# EAGLE design dimmer (EAGLE 7.6.0)
CREVISION: 1; DESIGNER: JoseM
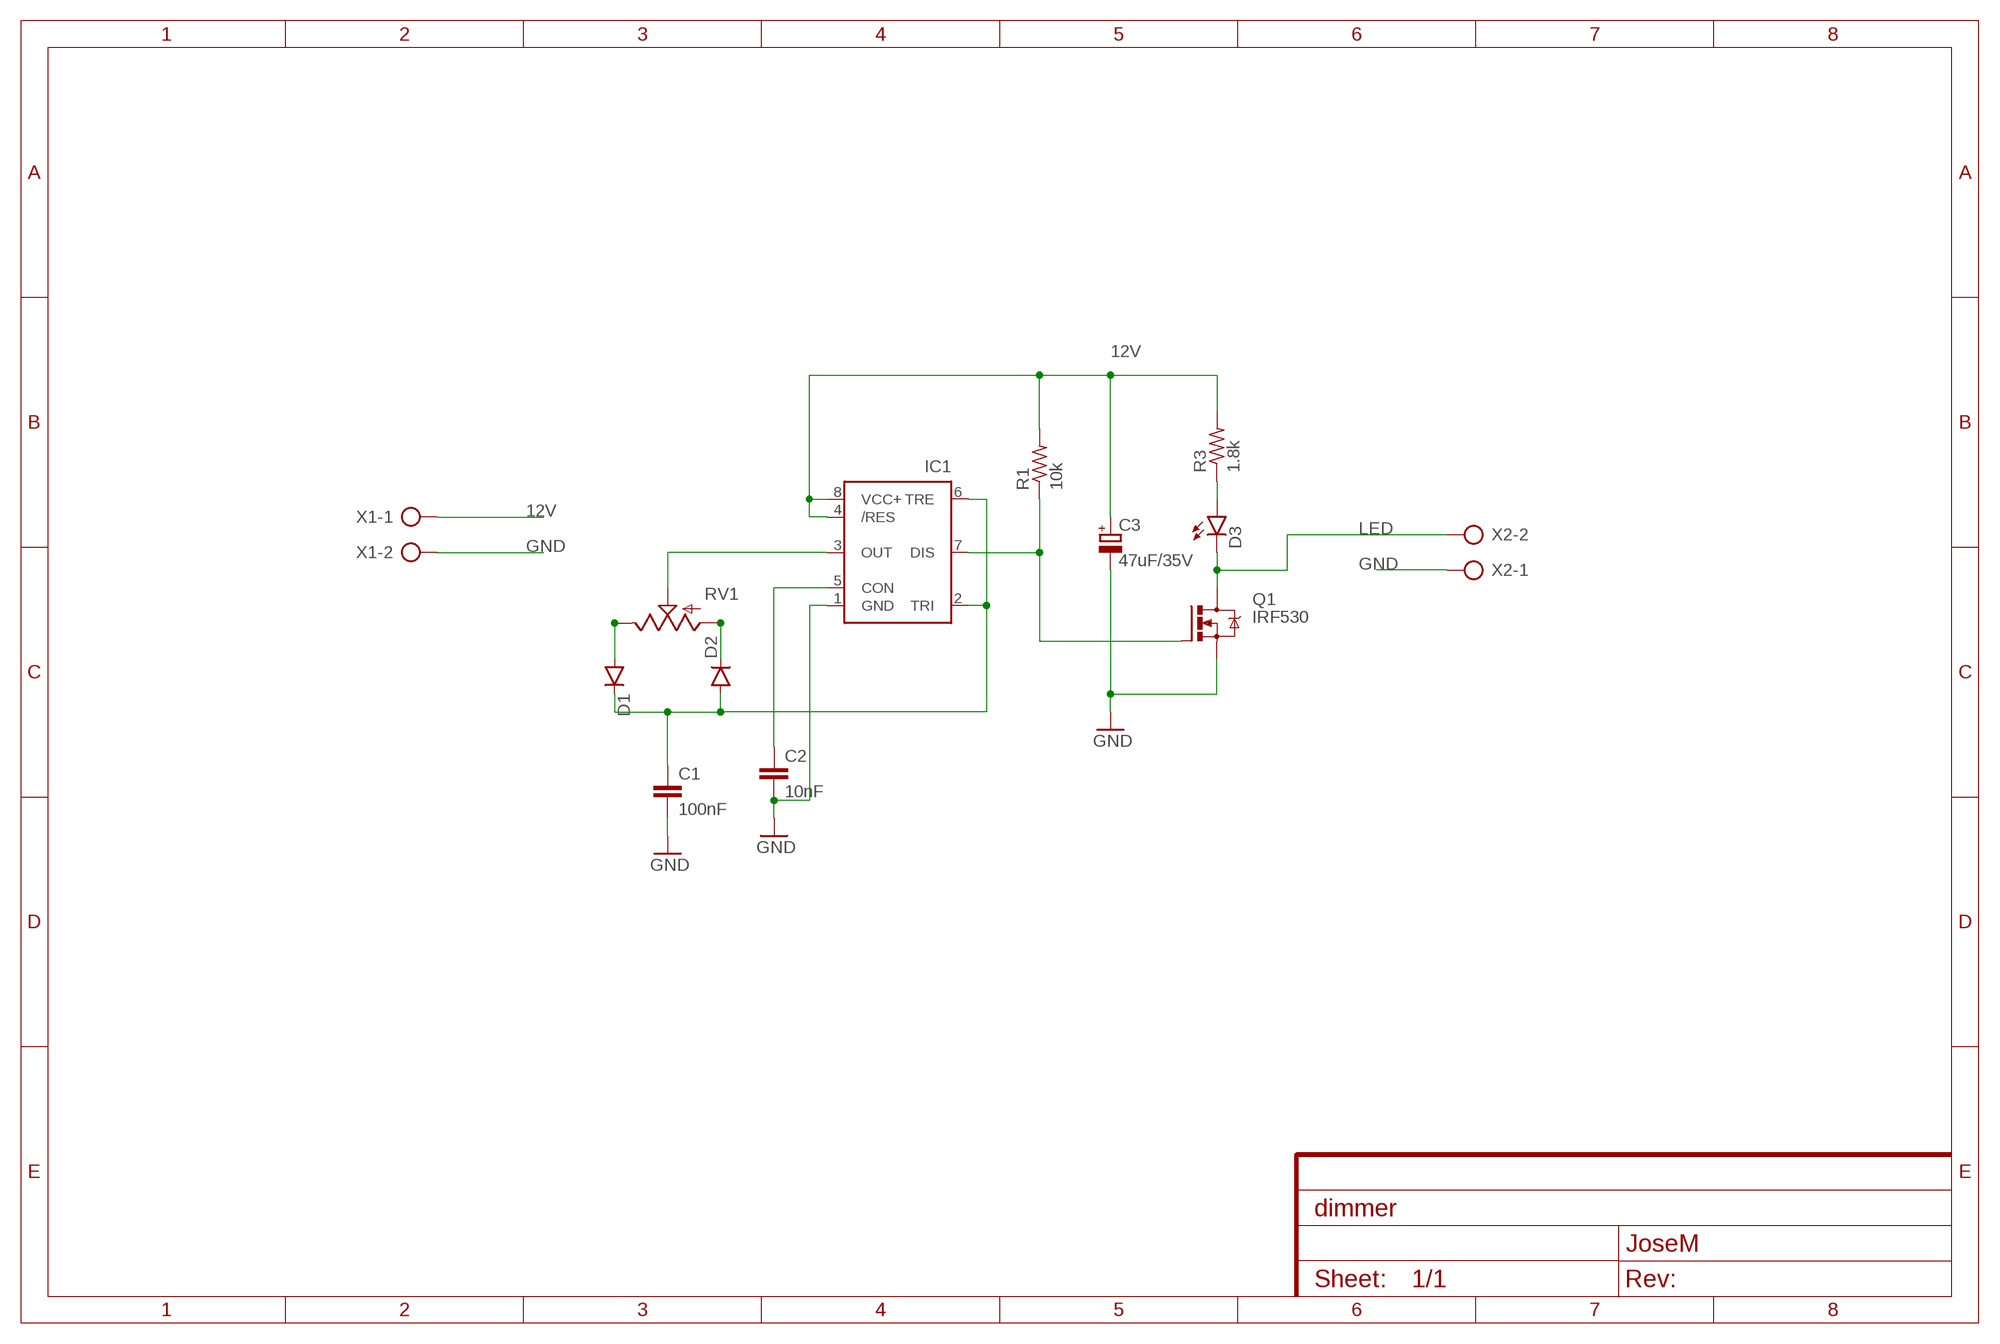
[diagram p0: schematic, sheet 1]
FRAME1 (FRAME-A4L): CREVISION: 1.1

## Parts
C1  100nF  C-EU050-025X075  [C050-025X075]
C2  10nF  C-EU050-025X075  [C050-025X075]
C3  47uF/35V  CPOL-EUE2.5-7  [E2,5-7]
D1  DIODE1N4148  [DIODE-1N4148]
D2  DIODE1N4148  [DIODE-1N4148]
D3  LED5MM  [LED5MM]
IC1  NE555P  [DIL-08]
Q1  IRF530  [TO220BV]
R1  10k  R-US_0207/10  [0207/10]
R3  1.8k  R-US_0207/10  [0207/10]
RV1  POT-RV16AF-20  [POT_ALPHA_RV16AF-20]
X1  AK300/2  [AK300/2]
X2  AK300/2  [AK300/2]

## Nets
12V: C3.+ IC1.4(/RES) IC1.8(VCC+) R1.2 R3.2 X1.1
GND: C1.2 C2.2 C3.- IC1.1(GND) Q1.S X1.2 X2.1
LED: D3.K(C) Q1.D X2.2
N$1: D1.A RV1.3(E)
N$2: D2.C RV1.1(A)
N$4: IC1.7(DIS) Q1.G R1.1
N$7: D3.A R3.1
N$8: IC1.3(OUT) RV1.2(S)
N$9: C1.1 D1.C D2.A IC1.2(TRI) IC1.6(TRE)
N$10: C2.1 IC1.5(CON)

## Library data of the parts
C1 C2 = rcl:C-EU: CAPACITOR, European symbol
C3 = rcl:CPOL-EU: POLARIZED CAPACITOR, European symbol
D1 D2 = SparkFun-DiscreteSemi:DIODE: Diode These are standard reverse protection diodes and small signal diodes. SMA package can handle up to about 1A. SOD-323 can handle about 200mA. What the SOD-323 package when ordering, there are some mfgs out there that are 5-pin packages.
D3 = SparkFun-LED:LED: LEDs Standard schematic elements and footprints for 5mm, 3mm, 1206, and 0603 sized LEDs. 5mm - Spark Fun Electronics SKU : COM-00529 (and others)
IC1 = SparkFun-AnalogIC:NE555: General purpose bipolar Timer; MF: Arrow Electronics; MPN: NE555N; OC_FARNELL: 1467742; OC_NEWARK: 89K1486
Q1 = transistor-power:IRF530: HEXFET Power MOSFET
R1 R3 = resistor:R-US_: RESISTOR, American symbol
RV1 = SparkFun-Electromechanical:POT
X1 X2 = con-ptr500:AK300/2: CONNECTOR; OC_FARNELL: unknown; OC_NEWARK: unknown

## Board
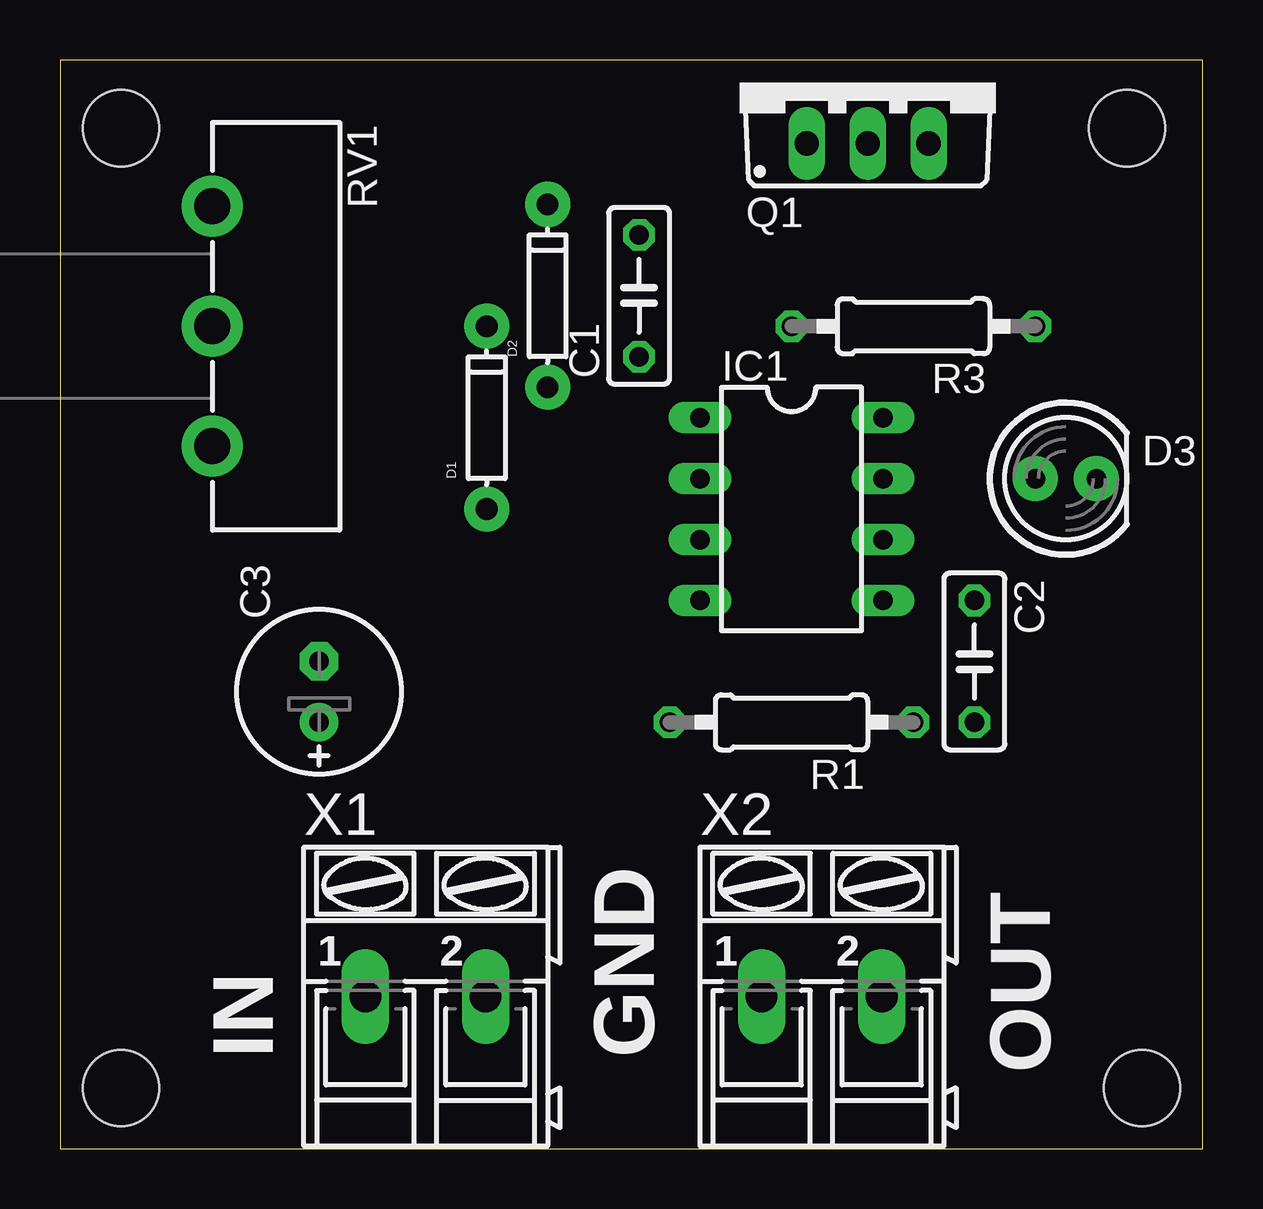
[diagram p1: board, top side]
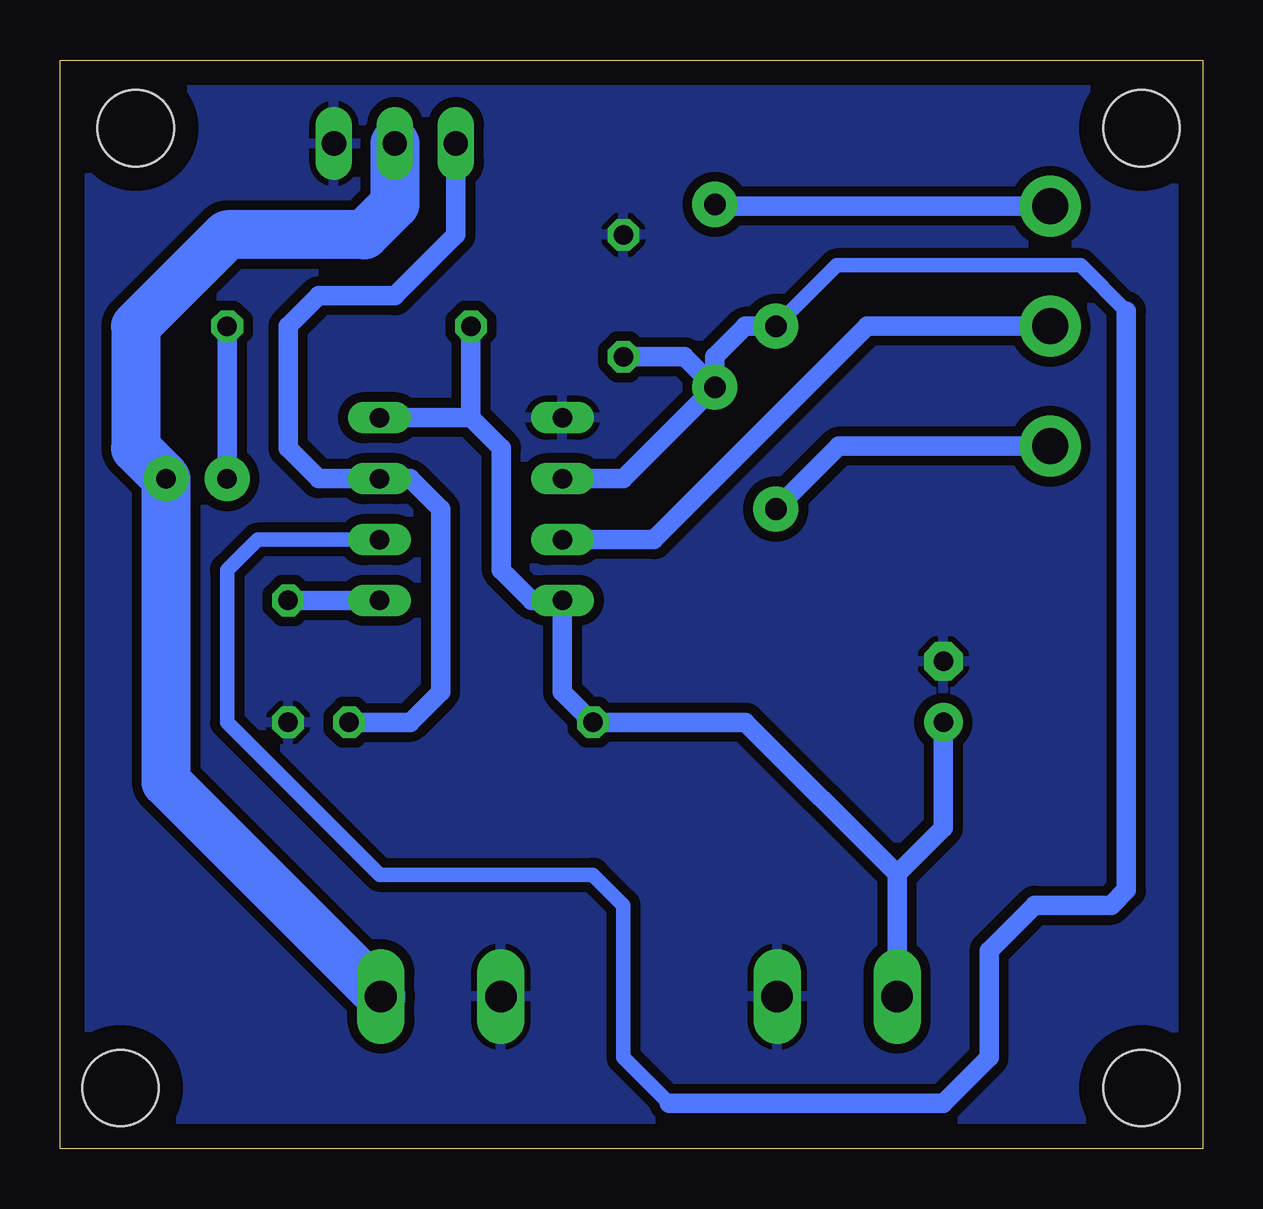
[diagram p2: board, bottom side, seen from below]

Size 47.6 x 45.39 mm. Coordinates in mm from the lower left corner, seen from the top.
Outline: 0,0 47.6,0 47.6,45.39 0,45.39 0,0
Copper layers (1*16): Top 0.035mm / dielectric 1.5mm / Bottom 0.035mm
Design rules "default": minimum track width 10mil, minimum drill 24mil, track to track 8mil, track to pad 8mil, pad to pad 8mil, via to via 8mil, smd to smd 8mil, copper to edge 40mil, drill to drill 8mil, minimum pad ring 10mil, minimum via ring 8mil, stop-mask expansion 4mil, vias tented up to drill 0mil, thermal gap 10mil
Holes 3.17 mm at 2.54,42.55 45.09,2.54 44.45,42.55 2.54,2.54

### Footprints (pad centres in the part's own frame; a part is rotated, then mirrored left to right if it is on the bottom)
C050-025X075 = drill 0.813 octagon: 1 -2.54,0; 2 2.54,0
E2,5-7 = drill 0.813 pad 1.6: + -1.27,0 | drill 0.813 pad 1.6 octagon: - 1.27,0
DIODE-1N4148 = drill 0.9 pad 1.88: A -3.81,0; C 3.81,0
LED5MM = drill 0.813 pad 1.88: A -1.27,0; K 1.27,0
DIL-08 = drill 0.813 long: 1 -3.81,-3.81; 2 -1.27,-3.81; 3 1.27,-3.81; 4 3.81,-3.81; 5 3.81,3.81; 6 1.27,3.81; 7 -1.27,3.81; 8 -3.81,3.81
TO220BV = drill 1.016 long: D 0,-2.54; G -2.54,-2.54; S 2.54,-2.54
0207/10 = drill 0.813 octagon: 1 -5.08,0; 2 5.08,0
POT_ALPHA_RV16AF-20 = drill 1.5 pad 2.54: 1 -5,0; 2 0,0; 3 5,0
AK300/2 = drill 1.321 long: 1 -2.515,0; 2 2.489,0

### Placement (x,y rotation side)
C1  24.13,35.56 90 top
C2  38.1,20.32 270 top
C3  10.79,19.05 90 top
D1  17.78,30.48 90 top
D2  20.32,35.56 90 top
D3  41.91,27.94 0 top
IC1  30.48,26.67 270 top
Q1  33.66,44.45 0 top
R1  30.48,17.78 180 top
R3  35.56,34.29 180 top
RV1  6.35,34.29 270 top
X1  15.24,6.35 0 top
X2  31.75,6.35 0 top

### Tracks (layer width: path | path; a pad name or v marks a point on that pad's centre or on a via)
12V
  Bottom 0.813: 30.48,30.48 29.21,29.21 29.21,24.13 27.94,22.86 IC1.4 26.67,19.05 R1.2 19.05,17.78 12.72,11.46 | 30.48,30.48 IC1.8 | R3.2 30.48,30.48 | X1.1 12.72,11.46 | C3.+ 10.79,13.39 12.72,11.46
GND
  pour Bottom (isolate 0.406): 0,0 157.48,0 157.48,100.33 0,100.33
LED
  Bottom 2.032: X2.2 43.18,15.29 D3.K 44.45,29.21 44.45,34.29 40.64,38.1 34.92,38.1 33.66,39.37 Q1.D
N$1
  Bottom 0.813: RV1.3 15.16,29.29 D1.A
N$2
  Bottom 0.813: RV1.1 20.24,39.29 D2.C
N$4
  Bottom 0.813: R1.1 33.02,17.78 31.75,19.05 31.75,26.67 33.02,27.94 IC1.7 36.83,27.94 38.1,29.21 38.1,34.29 36.83,35.56 33.66,35.56 31.11,38.1 Q1.G
N$7
  Bottom 0.813: R3.1 D3.A
N$8
  Bottom 0.813: RV1.2 13.97,34.29 22.86,25.4 IC1.3
N$9
  Bottom 0.61: 3.17,34.92 5.08,36.83 15.24,36.83 D1.C | IC1.6 39.37,25.4 40.64,24.13 40.64,17.78 34.29,11.43 25.4,11.43 24.13,10.16 24.13,3.81 22.23,1.91
  Bottom 0.813: D1.C 19.05,34.29 20.32,33.02 D2.A | D2.A 24.13,27.94 IC1.2 | C1.1 21.59,33.02 D2.A | 22.23,1.91 10.79,1.91 8.89,3.81 8.89,8.26 6.99,10.16 3.81,10.16 3.17,10.79 3.17,34.92
N$10
  Bottom 0.813: C2.1 IC1.5

### Text on the board
_tplace: 1 | 1 | 2 | 2 | 1 | 1 | 2 | 2 | IN | GND | OUT